# Altium schematic sheet jlink-ob.SchDoc
size A4
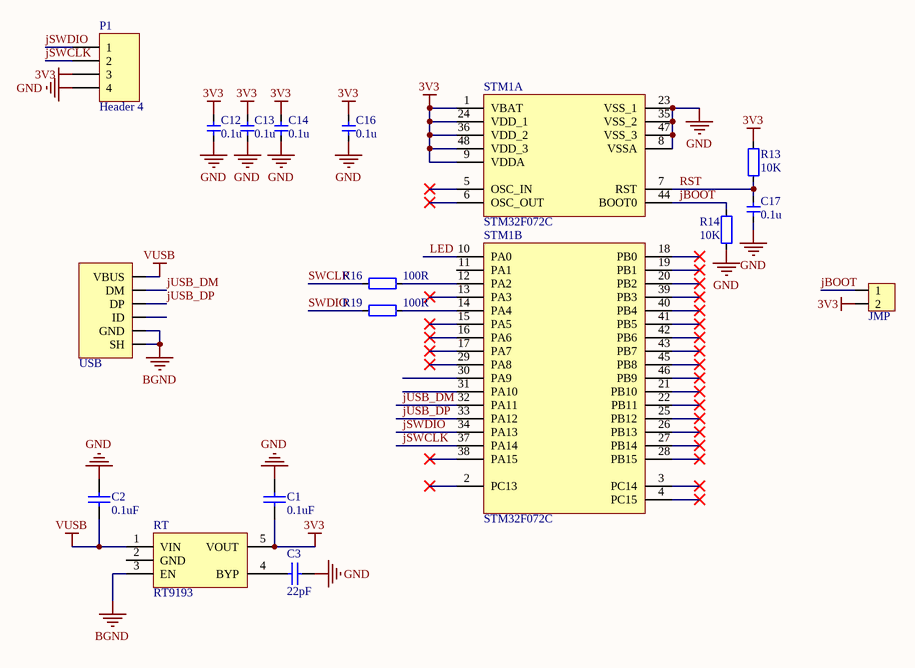
[diagram p0: jlink-ob.SchDoc]

## Parts
C1  value 0.1uF  [0805C]  (hidden comment: Cap)
C2  value 0.1uF  [0805C]  (hidden comment: Cap)
C3  value 22pF  [0805C]  (hidden comment: Cap)
C12  value 0.1u  [CAP_0603]  (hidden comment: Cap_0603)
C13  value 0.1u  [CAP_0603]  (hidden comment: Cap_0603)
C14  value 0.1u  [CAP_0603]  (hidden comment: Cap_0603)
C16  value 0.1u  [CAP_0603]  (hidden comment: Cap_0603)
C17  value 0.1u  [CAP_0603]  (hidden comment: Cap_0603)
JMP  HDR1x2_2.54  [HDR1X2_2.54_180]  (value not drawn)
P1  Header 4  [HDR1X4]
R13  value 10K  [RES_0603]  (hidden comment: Res_0603)
R14  value 10K  [RES_0603]  (hidden comment: Res_0603)
R16  value 100R  [RES_0603]  (hidden comment: Res_0603)
R19  value 100R  [RES_0603]  (hidden comment: Res_0603)
RT  RT9193  [SOT23-5]
STM1  STM32F072C  [LQFP_P0.5_48]  (parts A,B of 2)
USB  USB_Micro  [USB_Micro-AB]  (value not drawn)

## Nets
3V3: C1.1 C12.1 C13.1 C14.1 C16.2 JMP.2 P1.3 R13.2 RT.5(VOUT) STM1.1(VBAT) STM1.9(VDDA) STM1.24(VDD_1) STM1.36(VDD_2) STM1.48(VDD_3)
BGND: RT.3(EN) USB.0(SH) USB.5(GND)
GND: C1.2 C2.2 C3.2 C12.2 C13.2 C14.2 C16.1 C17.1 P1.4 R14.1 STM1.8(VSSA) STM1.23(VSS_1) STM1.35(VSS_2) STM1.47(VSS_3)
VUSB: C2.1 RT.1(VIN) USB.1(VBUS)
jBOOT: JMP.1 R14.2 STM1.44(BOOT0)
jSWCLK: P1.2 STM1.37(PA14)
jSWDIO: P1.1 STM1.34(PA13)
jUSB_DM: STM1.32(PA11) USB.2(DM)
jUSB_DP: STM1.33(PA12) USB.3(DP)
LED: STM1.10(PA0)
RST: C17.2 R13.1 STM1.7(RST)
SWCLK: R16.1
SWDIO: R19.1
NetC3_1: C3.1 RT.4(BYP)
NetR16_2: R16.2 STM1.12(PA2)
NetR19_2: R19.2 STM1.14(PA4)

Not connected (* = marked no-connect by the designer): RT 2(GND); STM1 2(PC13)* 3(PC14)* 4(PC15)* 5(OSC_IN)* 6(OSC_OUT)* 11(PA1) 13(PA3)* 15(PA5)* 16(PA6)* 17(PA7)* 18(PB0)* 19(PB1)* 20(PB2)* 21(PB10)* 22(PB11)* 25(PB12)* 26(PB13)* 27(PB14)* 28(PB15)* 29(PA8)* 30(PA9) 31(PA10) 38(PA15)* 39(PB3)* 40(PB4)* 41(PB5)* 42(PB6)* 43(PB7)* 45(PB8)* 46(PB9)*; USB 4(ID)

## Library data of the parts
C1-C3 = Cap: Capacitor; Published: 8-Jun-2000; LatestRevisionDate: 17-Jul-2002; LatestRevisionNote: Re-released for DXP Platform.; PackageReference: RAD-0.3; Publisher: Altium Limited
C12-C14 C16 C17 = Cap_0603: Capacitor
JMP = HDR1x2_2.54: Header
P1 = Header 4: Header, 4-Pin; LatestRevisionDate: 17-Jul-2002; LatestRevisionNote: Re-released for DXP Platform.; Publisher: Altium Limited
R13 R14 R16 R19 = Res_0603: Resistor
RT = RT9193: Power
STM1 = STM32F103C: MCU
USB = USB_Micro: USB